# EAGLE schematic ppgimp (EAGLE 9.3.1)

## Sheet 1 of 2
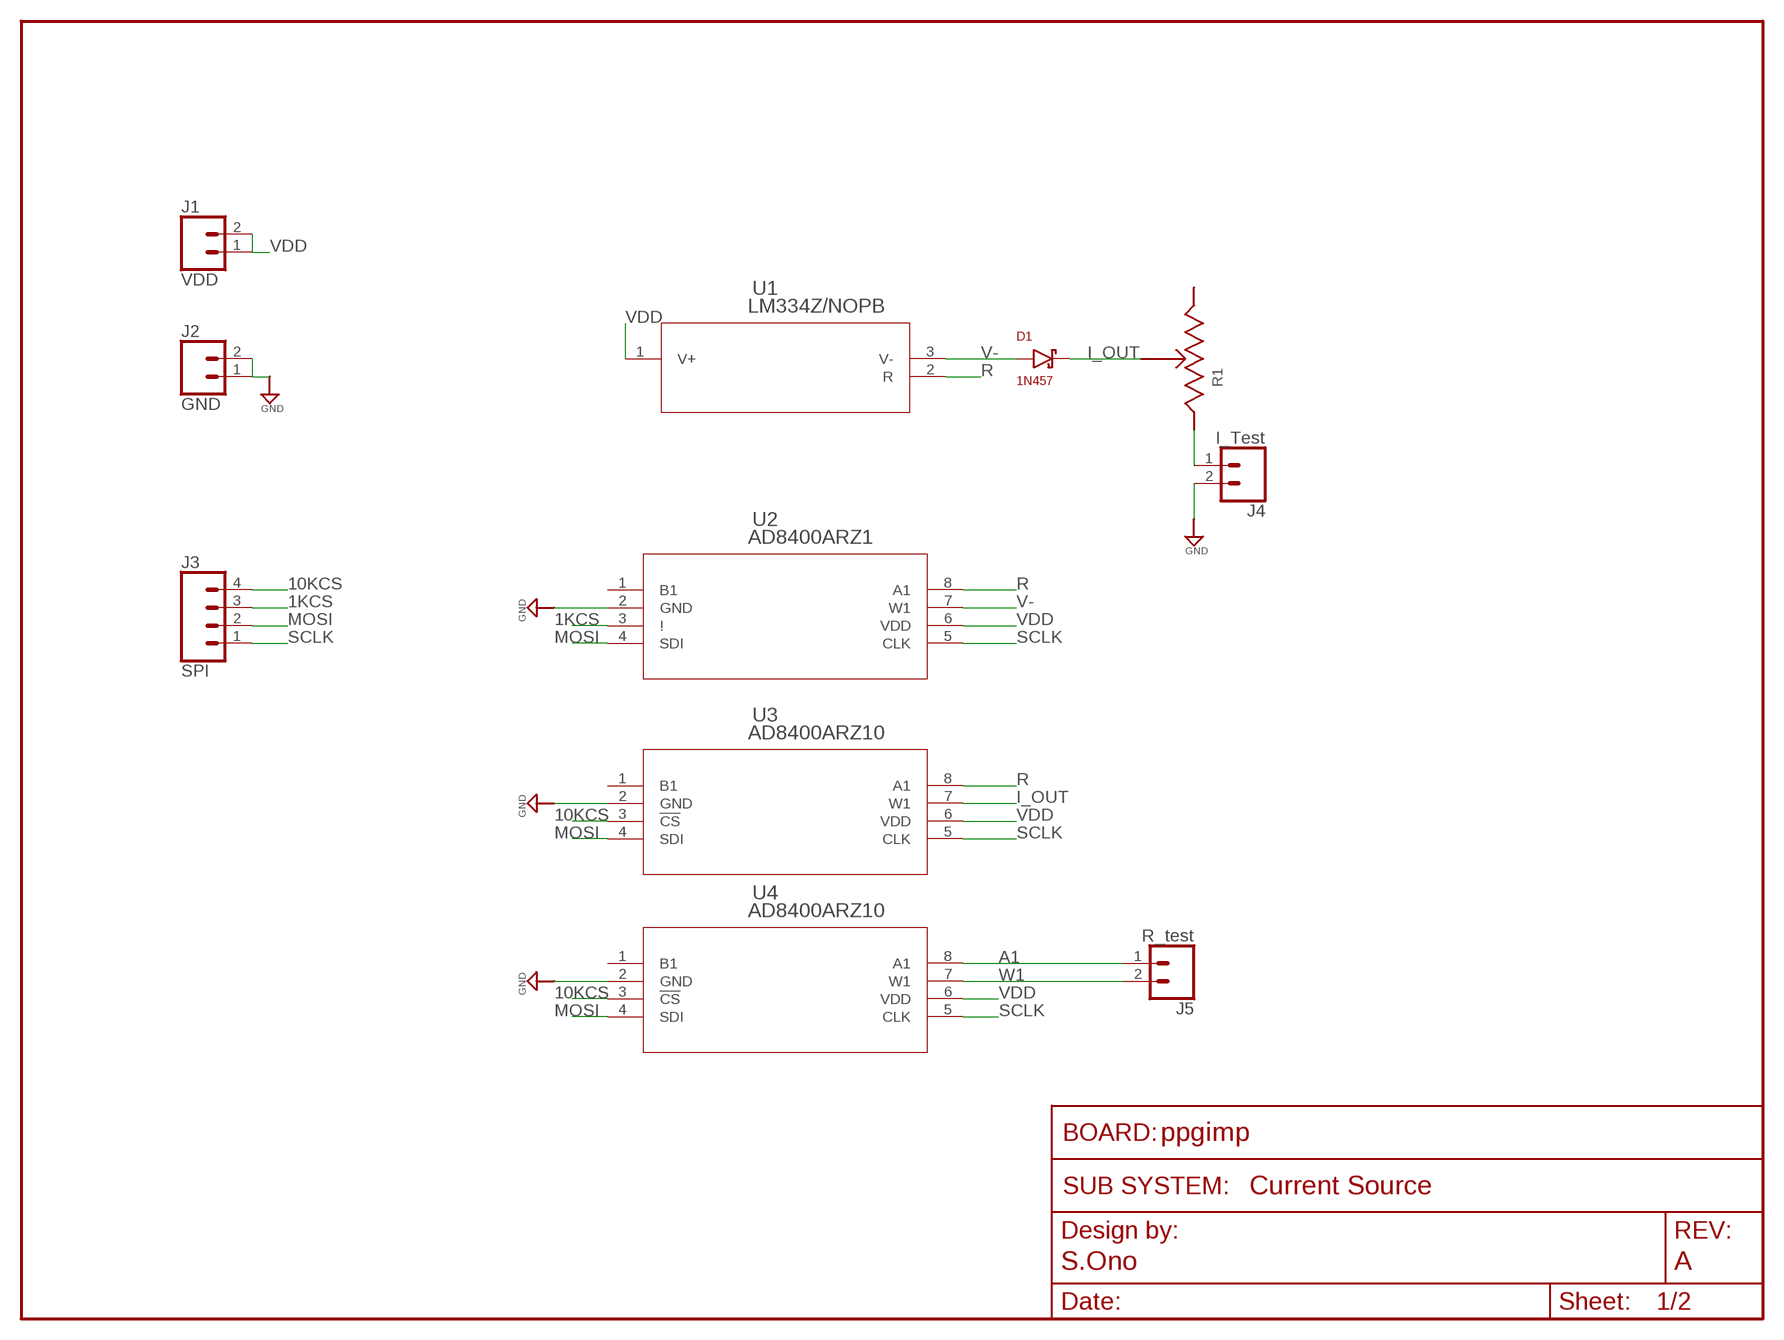
[diagram p0: schematic, sheet 1]
FRAME1 (FRAME_SCHEMATIC): AUTHOR: S.Ono; REV: A; SUBSYSTEM_NAME: Current Source

### Parts
D1  1N457  [DIODE_THRU]
J1  VDD  CONN_02  [1X02]
J2  GND  CONN_02  [1X02]
J3  SPI  CONN_04  [1X04]
J4  I_Test  CONN_02  [1X02]
J5  R_test  CONN_02  [1X02]
R1  POT-3PIN  [POT-3PIN]
U1  LM334Z/NOPB  [Z03A]
U2  AD8400ARZ1  [R_8]
U3  AD8400ARZ10  [R_8]
U4  AD8400ARZ10  [R_8]

### Nets
1KCS: J3.3 U2.3(!)
10KCS: J3.4 U3.3(!CS) U4.3(!CS)
A1: J5.1 U4.8(A1)
GND: J2.1 J2.2 J4.2 U2.2(GND) U3.2(GND) U4.2(GND) ; also sheet 2
I_OUT: D1.2(N) R1.2 U3.7(W1)
MOSI: J3.2 U2.4(SDI) U3.4(SDI) U4.4(SDI)
N$1: J4.1 R1.3
R: U1.2(R) U2.8(A1) U3.8(A1)
SCLK: J3.1 U2.5(CLK) U3.5(CLK) U4.5(CLK)
V-: D1.1(P) U1.3(V-) U2.7(W1)
VDD: J1.1 J1.2 U1.1(V+) U2.6(VDD) U3.6(VDD) U4.6(VDD) ; also sheet 2
W1: J5.2 U4.7(W1)
Unconnected: R1.1 U2.1(B1) U3.1(B1) U4.1(B1)

## Sheet 2 of 2
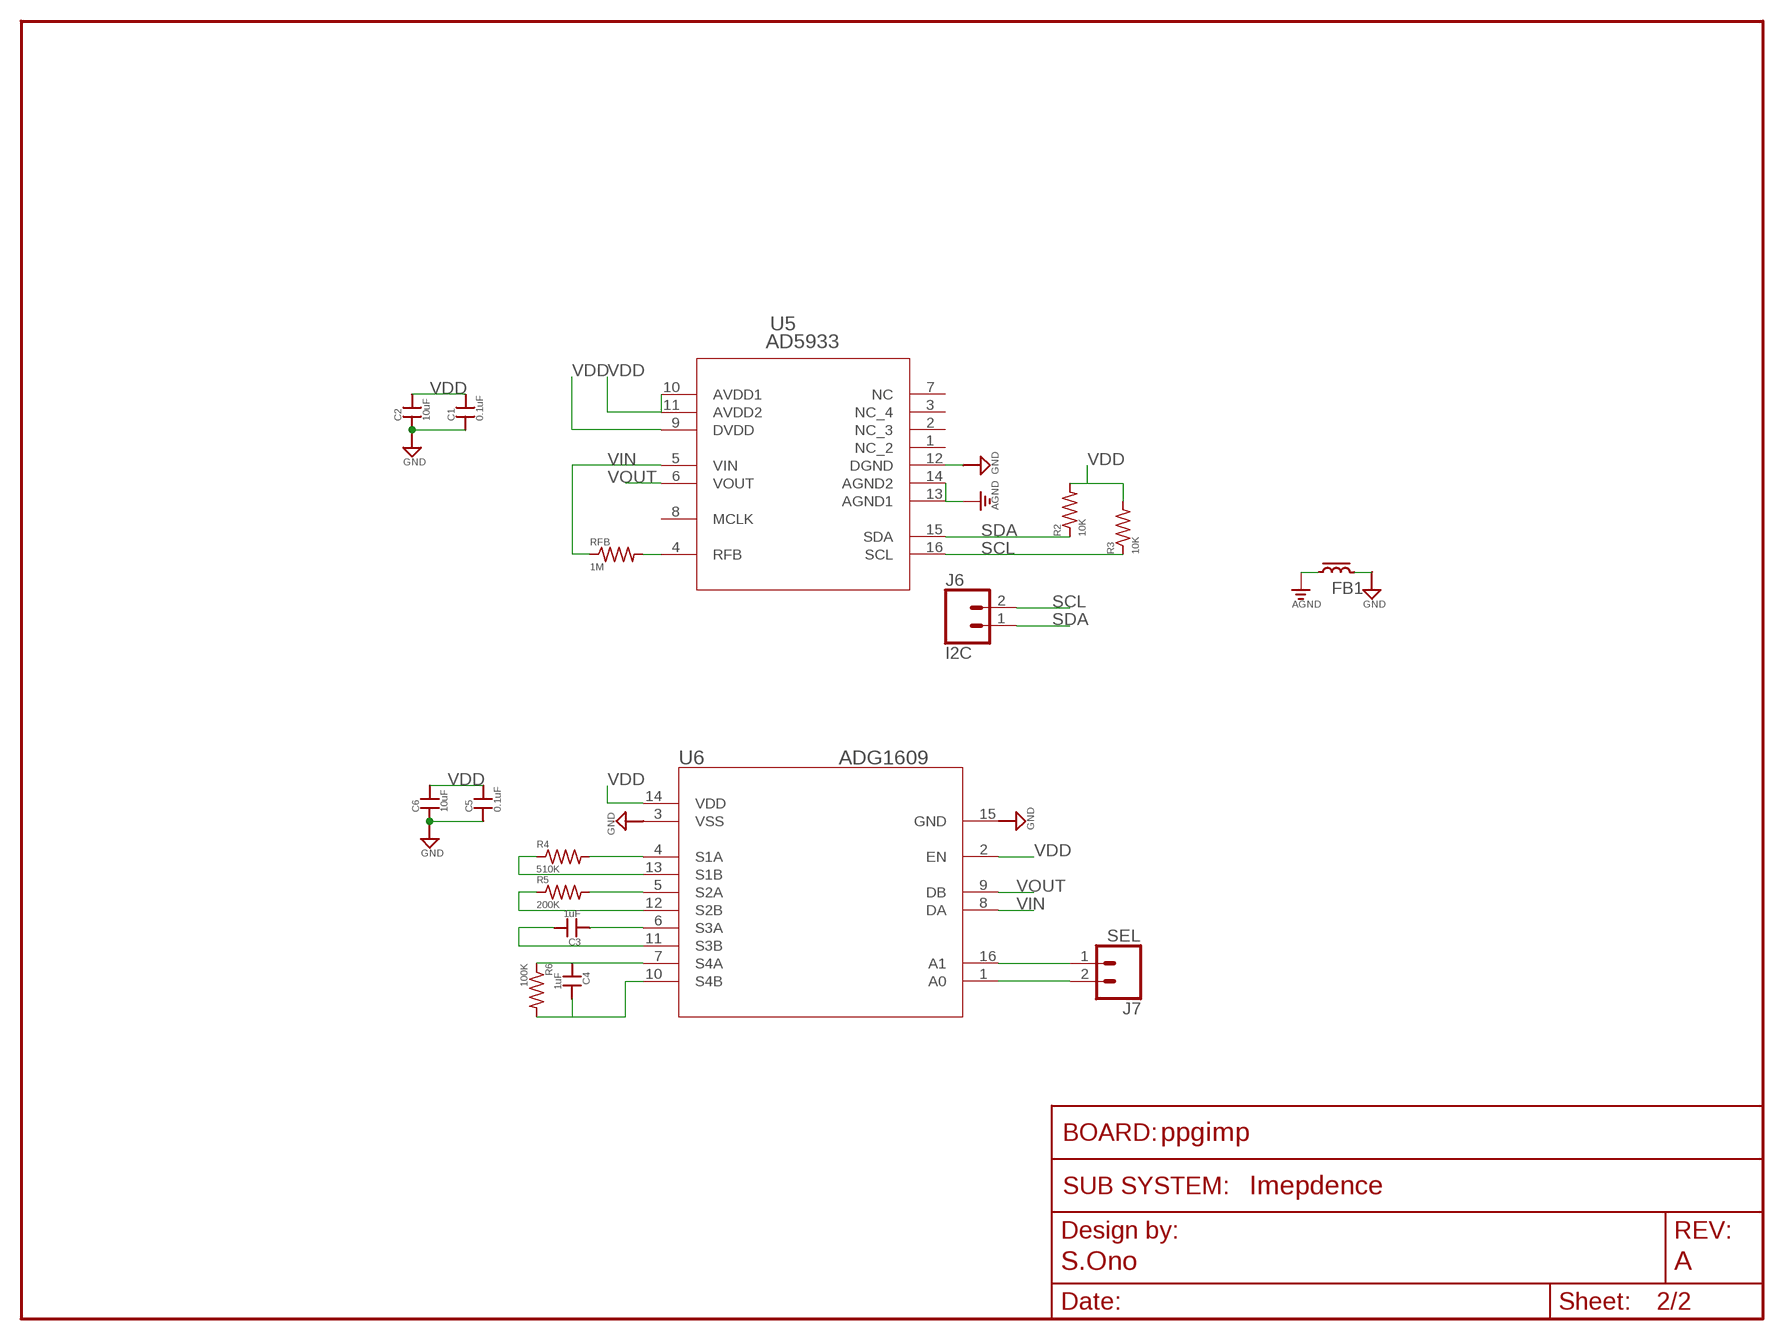
[diagram p1: schematic, sheet 2]
FRAME2 (FRAME_SCHEMATIC): AUTHOR: S.Ono; REV: A; SUBSYSTEM_NAME: Imepdence

### Parts
C1  0.1uF  CAP0603-CAP  [0603-CAP]
C2  10uF  CAP0603-CAP  [0603-CAP]
C3  1uF  CAP0603-CAP  [0603-CAP]
C4  1uF  CAP0603-CAP  [0603-CAP]
C5  0.1uF  CAP0603-CAP  [0603-CAP]
C6  10uF  CAP0603-CAP  [0603-CAP]
FB1  FERRITE  [0603-FERR]
J6  I2C  CONN_02  [1X02]
J7  SEL  CONN_02  [1X02]
R2  10K  R-US_R0603  [R0603]
R3  10K  R-US_R0603  [R0603]
R4  510K  R-US_R0603  [R0603]
R5  200K  R-US_R0603  [R0603]
R6  100K  R-US_R0603  [R0603]
RFB  1M  R-US_R0603  [R0603]
U5  AD5933  AD5933YRSZ  [RS_16]
U6  ADG1609  [RU_16]

### Nets
AGND: FB1.1 U5.13(AGND1) U5.14(AGND2)
GND: C1.1 C2.1 C5.1 C6.1 FB1.2 U5.12(DGND) U6.3(VSS) U6.15(GND) ; also sheet 1
N$2: RFB.2 U5.4(RFB)
N$3: J7.1 U6.16(A1)
N$4: J7.2 U6.1(A0)
N$5: R4.2 U6.4(S1A)
N$6: R4.1 U6.13(S1B)
N$7: R5.2 U6.5(S2A)
N$8: R5.1 U6.12(S2B)
N$9: C3.1 U6.6(S3A)
N$10: C3.2 U6.11(S3B)
N$11: C4.1 R6.1 U6.7(S4A)
N$12: C4.2 R6.2 U6.10(S4B)
SCL: J6.2 R3.1 U5.16(SCL)
SDA: J6.1 R2.1 U5.15(SDA)
VDD: C1.2 C2.2 C5.2 C6.2 R2.2 R3.2 U5.9(DVDD) U5.10(AVDD1) U5.11(AVDD2) U6.2(EN) U6.14(VDD) ; also sheet 1
VIN: RFB.1 U5.5(VIN) U6.8(DA)
VOUT: U5.6(VOUT) U6.9(DB)
Unconnected: U5.1(NC_2) U5.2(NC_3) U5.3(NC_4) U5.7(NC) U5.8(MCLK)

## Library data of the parts
C1-C6 = scono:CAP: Capacitor Standard 0603 ceramic capacitor, and 0.1" leaded capacitor.; PIE-INT-REF-NUM: CAPACITOR-GENERIC
D1 = scono:1N457: https://www.digikey.com/product-detail/en/on-semiconductor/1N457TR/1N457CT-ND/1532749
FB1 = scono:FERRITE: https://www.digikey.com/product-detail/en/wurth-electronics-inc/742792651/732-1593-1-ND/1639537
J1 J2 J4-J7 = scono:CONN_02: Multi connection point. Often used as Generic Header-pin footprint for 0.1 inch spaced/style header connections On any of the 0.1 inch spaced packages, you can populate with these: Break Away Headers - Straight <https://www.sparkfun.com/products/116> (PRT-00116) Break Away Male Headers - Right Angle <https://www.sparkfun.com/products/553> (PRT-00553) Female Headers <https://www.sparkfun.com/products/115> (PRT-00115) Break Away Headers - Machine Pin <https://www.sparkfun.com/products/117> (PRT-00117) Break Away Female Headers - Swiss Machine Pin <https://www.sparkfun.com/products/743> (PRT-00743) For SCREWTERMINALS and SPRING TERMINALS visit here: Screw Terimnals on SparkFun.com <https://www.sparkfun.com/search/results?term=Screw+Terminals> (5mm/3.5mm/2.54mm spacing) This device is also useful as a general connection point to wire up your design to another part of your project. Our various solder wires solder well into these plated through hole pads. Hook-Up Wire - Assortment (Stranded, 22 AWG) <https://www.sparkfun.com/products/11375> (PRT-11375) Hook-Up Wire - Assortment (Solid Core, 22 AWG) <https://www.sparkfun.com/products/11367> (PRT-11367) View the entire wire category on our website here <https://www.sparkfun.com/categories/141> Special notes: Molex polarized connector foot print use with: PRT-08233 with associated crimp pins and housings. 2.54_SCREWTERM for use with PRT-10571. 3.5mm Screw Terminal footprints for PRT-08084 5mm Screw Terminal footprints for use with PRT-08432
J3 = scono:CONN_04: Multi connection point. Often used as Generic Header-pin footprint for 0.1 inch spaced/style header connections On any of the 0.1 inch spaced packages, you can populate with these: Break Away Headers - Straight <https://www.sparkfun.com/products/116> (PRT-00116) Break Away Male Headers - Right Angle <https://www.sparkfun.com/products/553> (PRT-00553) Female Headers <https://www.sparkfun.com/products/115> (PRT-00115) Break Away Headers - Machine Pin <https://www.sparkfun.com/products/117> (PRT-00117) Break Away Female Headers - Swiss Machine Pin <https://www.sparkfun.com/products/743> (PRT-00743) For SCREWTERMINALS and SPRING TERMINALS visit here: Screw Terimnals on SparkFun.com <https://www.sparkfun.com/search/results?term=Screw+Terminals> (5mm/3.5mm/2.54mm spacing) This device is also useful as a general connection point to wire up your design to another part of your project. Our various solder wires solder well into these plated through hole pads. Hook-Up Wire - Assortment (Stranded, 22 AWG) <https://www.sparkfun.com/products/11375> (PRT-11375) Hook-Up Wire - Assortment (Solid Core, 22 AWG) <https://www.sparkfun.com/products/11367> (PRT-11367) View the entire wire category on our website here <https://www.sparkfun.com/categories/141> Special notes: Molex polarized connector foot print use with SKU : PRT-08231 with associated crimp pins and housings. 1MM SMD Version SKU: PRT-10208; PROD_ID: CONN-09696
R1 = scono:POT-3PIN: https://www.digikey.com/product-detail/en/bourns-inc/3310Y-001-103L/3310Y-001-103L-ND/1088215
R2-R6 RFB = scono:R-US_: RESISTOR, American symbol; DESCRIPTION: RESISTOR, American symbol; DISTRIBUTOR: DigiKey; MANUFACTURER: Rohm Semiconductor; NOTES: Cut Tape; PACKAGE: R0603
U1 = scono:LM334Z/NOPB; MANUFACTURER_PART_NUMBER: LM334ZNOPB; VENDOR: Texas Instruments
U2 = scono:AD8400ARZ1; MANUFACTURER_PART_NUMBER: AD8400ARZ1; VENDOR: Analog Devices Inc
U3 U4 = scono:AD8400ARZ10; MANUFACTURER_PART_NUMBER: AD8400ARZ10; VENDOR: Analog Devices Inc
U5 = scono:AD5933YRSZ: https://www.digikey.com/product-detail/en/AD5933YRSZ/AD5933YRSZ-ND/756602?utm_campaign=buynow&WT.z_cid=ref_octopart_dkc_buynow&utm_medium=aggregator&curr=usd&site=us&utm_source=octopart; MANUFACTURER_PART_NUMBER: AD5933YRSZ; VENDOR: Analog Devices Inc
U6 = scono:ADG1609; MANUFACTURER_PART_NUMBER: ADG1609BRUZ; VENDOR: Analog Devices Inc